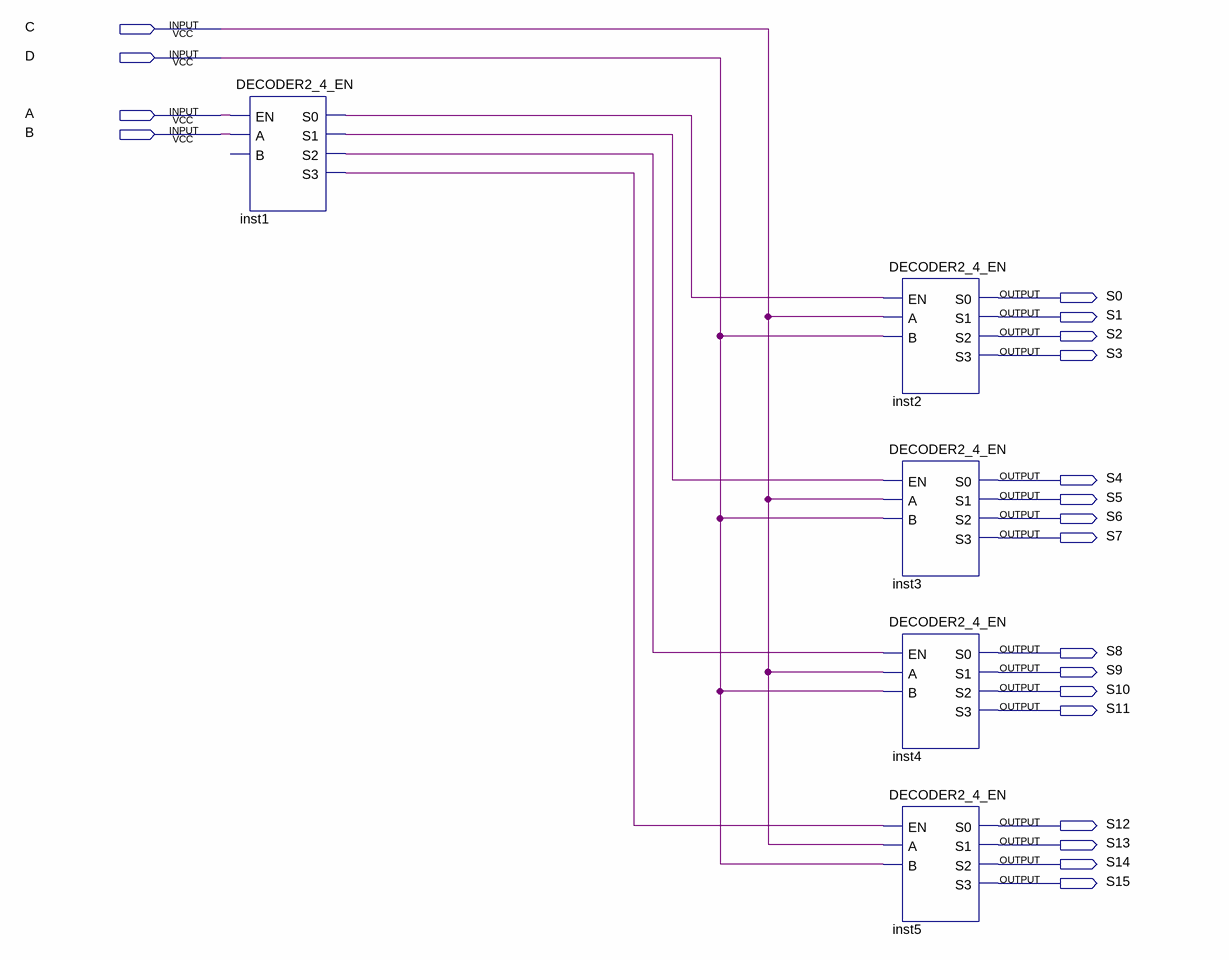
[diagram p0: schematic sheet]
// Quartus schematic DECODER4_16_EN.bdf as structural Verilog: 5 symbols, 20 pins
module DECODER4_16_EN (
  input  C,
  input  D,
  input  A,
  input  B,
  output S0,
  output S1,
  output S2,
  output S3,
  output S4,
  output S5,
  output S6,
  output S7,
  output S8,
  output S9,
  output S10,
  output S11,
  output S12,
  output S13,
  output S14,
  output S15
);

  wire inst1_s0, inst1_s1, inst1_s2, inst1_s3;

  DECODER2_4_EN inst1 (.EN(A), .A(B), .S0(inst1_s0), .S1(inst1_s1), .S2(inst1_s2), .S3(inst1_s3));  // open: B
  DECODER2_4_EN inst2 (.EN(inst1_s0), .A(C), .B(D), .S0(S0), .S1(S1), .S2(S2), .S3(S3));
  DECODER2_4_EN inst3 (.EN(inst1_s1), .A(C), .B(D), .S0(S4), .S1(S5), .S2(S6), .S3(S7));
  DECODER2_4_EN inst4 (.EN(inst1_s2), .A(C), .B(D), .S0(S8), .S1(S9), .S2(S10), .S3(S11));
  DECODER2_4_EN inst5 (.EN(inst1_s3), .A(C), .B(D), .S0(S12), .S1(S13), .S2(S14), .S3(S15));
endmodule
